# EAGLE schematic syma_mod (EAGLE 7.1.0)
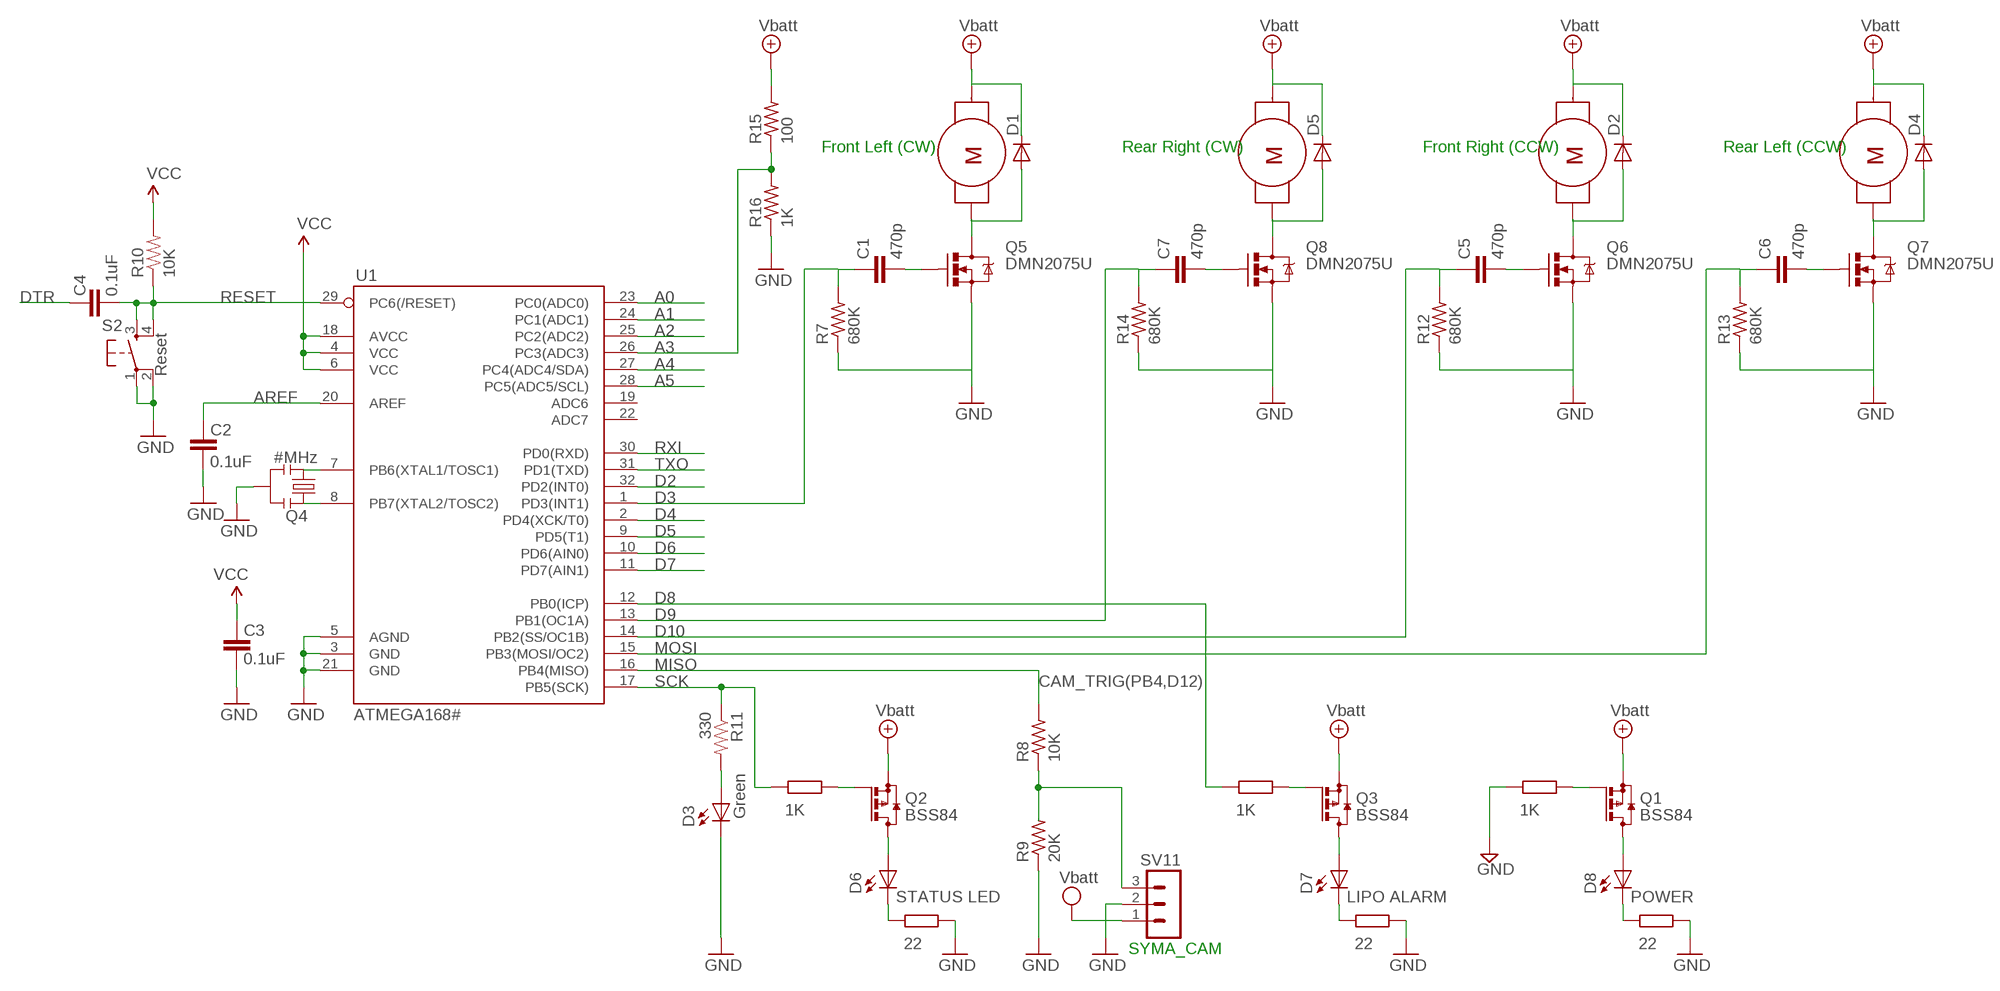
[diagram p0: schematic, sheet 1]
R1 (R): R: 1K
R2 (R): R: 1K
R3 (R): R: 22
R4 (R): R: 22
R5 (R): R: 1K
R6 (R): R: 22

## Parts
C1  470p  C-EUC0603  [C0603]
C2  0.1uF  CAP0402  [C0402]
C3  0.1uF  CAP0402  [C0402]
C4  0.1uF  CAP0402  [C0402]
C5  470p  C-EUC0603  [C0603]
C6  470p  C-EUC0603  [C0603]
C7  470p  C-EUC0603  [C0603]
D1  DIODE-MINIMELF  [MINIMELF]
D2  DIODE-MINIMELF  [MINIMELF]
D3  Green  LED0603  [LED-0603]
D4  DIODE-MINIMELF  [MINIMELF]
D5  DIODE-MINIMELF  [MINIMELF]
D6  STATUS LED  LED0603  [LED-0603]
D7  LIPO ALARM  LED0603  [LED-0603]
D8  POWER  LED0603  [LED-0603]
M1  MOTORARM-CORNER  [MOTOR-CORNER-2]
M2  MOTORARM-CORNER  [MOTOR-CORNER-2]
M3  MOTORARM-CORNER  [MOTOR-CORNER-2]
M4  MOTORARM-CORNER  [MOTOR-CORNER-2]
Q1  BSS84  [SOT23]
Q2  BSS84  [SOT23]
Q3  BSS84  [SOT23]
Q4  #MHz  RESONATORSMD  [RESONATOR-SMD]
Q5  DMN2075U  MOSFET-NCHANNELSMD  [SOT23-3]
Q6  DMN2075U  MOSFET-NCHANNELSMD  [SOT23-3]
Q7  DMN2075U  MOSFET-NCHANNELSMD  [SOT23-3]
Q8  DMN2075U  MOSFET-NCHANNELSMD  [SOT23-3]
R7  680K  R-US_R0603  [R0603]
R8  10K  R-US_R0603  [R0603]
R9  20K  R-US_R0603  [R0603]
R10  10K  RESISTOR0402  [C0402]
R11  330  RESISTOR0402  [C0402]
R12  680K  R-US_R0603  [R0603]
R13  680K  R-US_R0603  [R0603]
R14  680K  R-US_R0603  [R0603]
R15  100  R-US_R0603  [R0603]
R16  1K  R-US_R0603  [R0603]
S2  Reset  TAC_SWITCHSND  [TACTILE_SWITCH_SMD]
SV11  MA03-1  [MA03-1]
U1  ATMEGA168#  ATMEGA168  [TQFP32-08]

## Nets
+5V: Q1.2(S) Q2.2(S) Q3.2(S) R15.2 ; supply symbol labelled Vbatt
A0: U1.23(PC0(ADC0))
A1: U1.24(PC1(ADC1))
A2: U1.25(PC2(ADC2))
A3: R15.1 R16.2 U1.26(PC3(ADC3))
A4: U1.27(PC4(ADC4/SDA))
A5: U1.28(PC5(ADC5/SCL))
AREF: C2.2 U1.20(AREF)
CAM_TRIG(PB4,D12): R8.2
D2: U1.32(PD2(INT0))
D3: C1.1 R7.2 U1.1(PD3(INT1))
D4: U1.2(PD4(XCK/T0))
D5: U1.9(PD5(T1))
D6: U1.10(PD6(AIN0))
D7: U1.11(PD7(AIN1))
D8: U1.12(PB0(ICP))
D9: C7.1 R14.2 U1.13(PB1(OC1A))
D10: C5.1 R12.2 U1.14(PB2(SS/OC1B))
DTR: C4.2
GND: C2.1 C3.1 D3.C Q4.2 Q5.2(S) Q6.2(S) Q7.2(S) Q8.2(S) R7.1 R9.1 R12.1 R13.1 R14.1 R16.1 S2.1 S2.2 SV11.2 U1.3(GND) U1.5(AGND) U1.21(GND)
MISO: U1.16(PB4(MISO))
MOSI: C6.1 R13.2 U1.15(PB3(MOSI/OC2))
N$1: D6.A Q2.3(D)
N$2: D6.C
N$3: Q2.1(G)
N$4: D7.A Q3.3(D)
N$5: D7.C
N$6: Q3.1(G)
N$7: D8.A Q1.3(D)
N$8: D8.C
N$9: Q1.1(G)
N$10: D3.A R11.2
N$11: Q4.1 U1.8(PB7(XTAL2/TOSC2))
N$12: Q4.3 U1.7(PB6(XTAL1/TOSC1))
N$13: D2.A M1.B@1 Q6.3(D)
N$14: C5.2 Q6.1(G)
N$15: D4.A M2.B@1 Q7.3(D)
N$16: C6.2 Q7.1(G)
N$17: D5.A M3.B@1 Q8.3(D)
N$18: C7.2 Q8.1(G)
N$20: D1.A M4.B@1 Q5.3(D)
N$45: C1.2 Q5.1(G)
RESET: C4.1 R10.1 S2.3 S2.4 U1.29(PC6(/RESET))
RXI: U1.30(PD0(RXD))
SCK: R11.1 U1.17(PB5(SCK))
SYMA_CAM_TRIG: R8.1 R9.2 SV11.3
TXO: U1.31(PD1(TXD))
VBATT: D1.C D2.C D4.C D5.C M1.A@1 M2.A@1 M3.A@1 M4.A@1 ; supply symbol labelled Vbatt
VCC: C3.2 R10.2 SV11.1 U1.4(VCC) U1.6(VCC) U1.18(AVCC) ; supply symbol labelled Vbatt
Unconnected: U1.19(ADC6) U1.22(ADC7)

## Notes on the sheet
- Front Left (CW) | Rear Right (CW) | Front Right (CCW) | Rear Left (CCW)
- SYMA_CAM

## Library data of the parts
C1 C5-C7 = rcl:C-EU: CAPACITOR, European symbol
C2-C4 = SparkFun:CAP: Capacitor Standard 0603 ceramic capacitor, and 0.1" leaded capacitor.
D1 D2 D4 D5 = palmquad_alpha:DIODE-: DIODE
D3 D6-D8 = SparkFun:LED: LEDs Standard schematic elements and footprints for 5mm, 3mm, 1206, and 0603 sized LEDs. 5mm - Spark Fun Electronics SKU : COM-00529 (and others)
M1-M4 = palmquad_alpha:MOTOR
Q1-Q3 = transistor-small-signal:BSS84: P-CHANNEL MOS FET
Q4 = SparkFun:RESONATOR: Resonator Small SMD resonator. This is the itty bitty 10/20MHz resonators with built in caps. CSTCE10M0G55 and CSTCE20M0V53. Footprint has been reviewed closely but hasn't been tested yet.
Q5-Q8 = palmquad_alpha:MOSFET-NCHANNEL
R7-R9 R12-R16 = rcl:R-US_: RESISTOR, American symbol
R10 R11 = SparkFun:RESISTOR: Resistor Basic schematic elements and footprints for 0603, 1206, and PTH 1/10th watt (small) resistors.
S2 = SparkFun:TAC_SWITCH: Momentary Switch Button commonly used for reset or general input. Spark Fun Electronics SKU : COM-00097
SV11 = con-lstb:MA03-1: PIN HEADER; OC_FARNELL: unknown; OC_NEWARK: unknown
U1 = SparkFun:ATMEGA168

## Net classes
1 vcc: width 0.254 mm